# Altium schematic sheet PAGE02_机场端电源.SchDoc
size A4
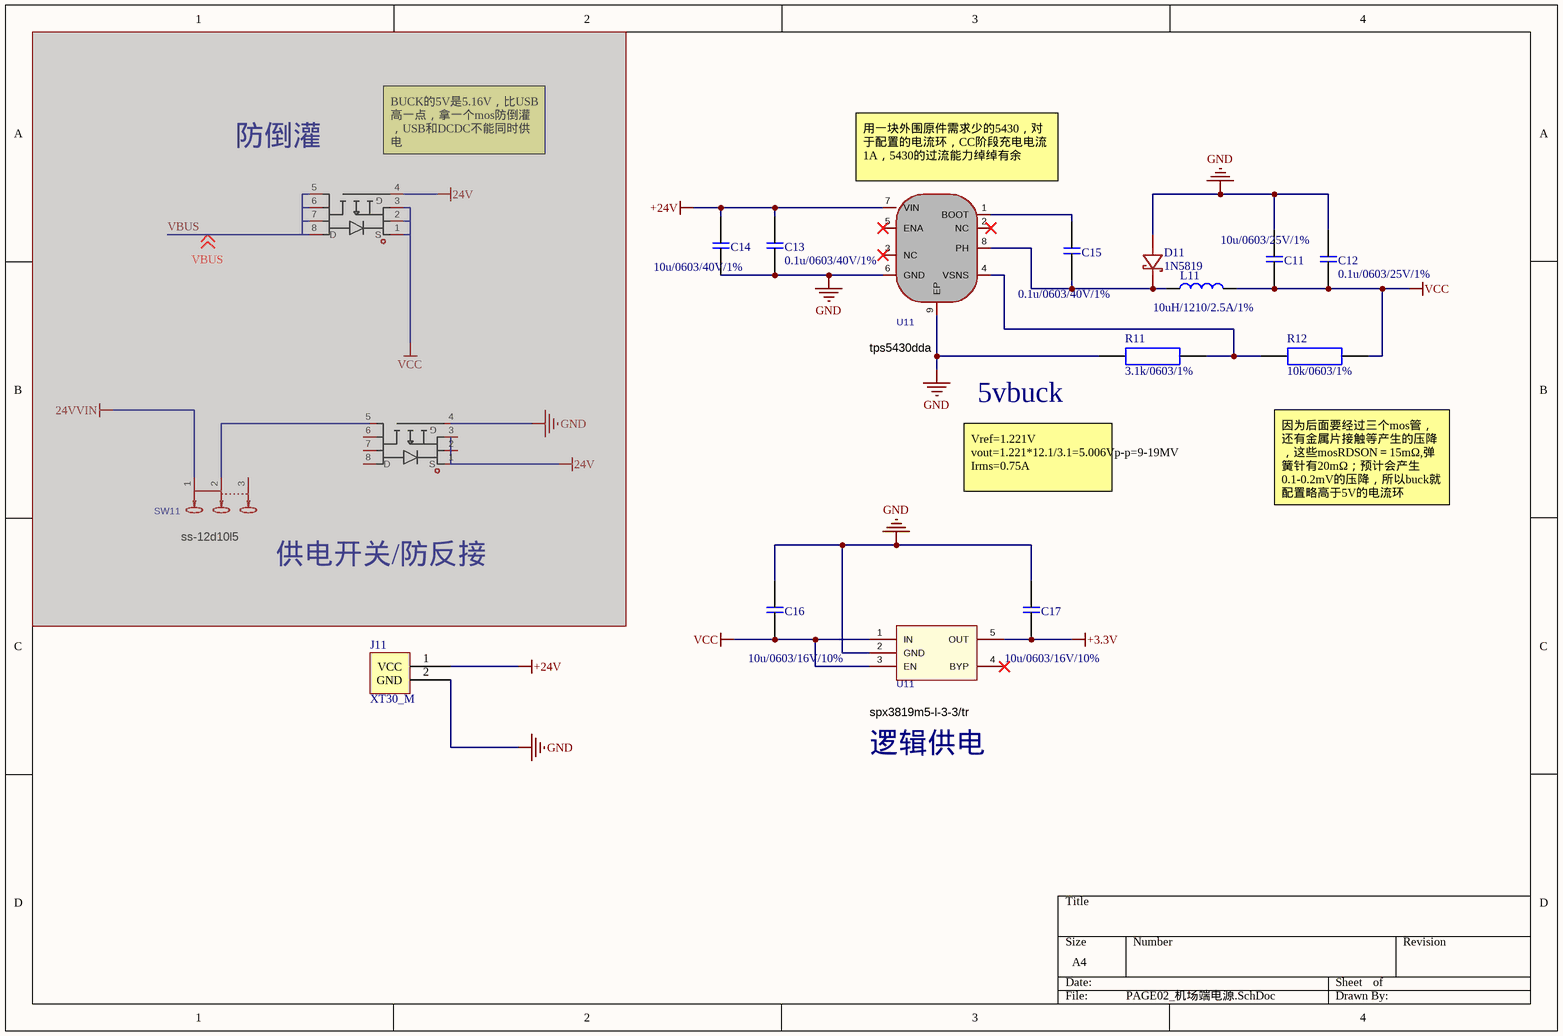
[diagram p0: PAGE02_机场端电源.SchDoc]

## Parts
(Parts that share a designator on the sheet are numbered #1, #2 ... from top to bottom, then left to right.)
C11  10u/0603/25V/1%  [0603_ding_C]
C12  0.1u/0603/25V/1%  [0603_ding_C]
C13  0.1u/0603/40V/1%  [0603_ding_C]
C14  10u/0603/40V/1%  [0603_ding_C]
C15  0.1u/0603/40V/1%  [0603_ding_C]
C16  10u/0603/16V/10%  [0603_ding_C]
C17  10u/0603/16V/10%  [0603_ding_C]
D11  1N5819  [SMA_L4.4-W2.6-LS5.0-RD]
J11  XT30_M  [XT30（立式）]
L11  10uH/1210/2.5A/1%  [1210_ding_C]
Q11  ao4435  [SOP-8_L5.0-W3.8-P1.27-LS6.0-BL]  (value not drawn)  (masked out: inside a compile mask, not in the netlist)
Q12  ao4435  [SOP-8_L5.0-W3.8-P1.27-LS6.0-BL]  (value not drawn)  (masked out: inside a compile mask, not in the netlist)
R11  3.1k/0603/1%  [0603_ding_R]
R12  10k/0603/1%  [0603_ding_R]
SW11  ss-12d10l5  [SW-TH_SS-12D10L5]  (masked out: inside a compile mask, not in the netlist)
U11#1  tps5430dda  [SOIC-8_EP_150mil]
U11#2  spx3819m5-l-3-3/tr  [SOT-23-5_L3.0-W1.7-P0.95-LS2.8-BL]

## Nets
+3.3V: C17.1 U11#2.5(OUT)
+24V: C13.2 C14.2 J11.1(VCC) U11#1.7(VIN)
GND: C11.2 C12.2 C13.1 C14.1 C16.2 C17.2 D11.2(A) J11.2(GND) R11.2 U11#1.6(GND) U11#1.9(EP) U11#2.2(GND)
VCC: C11.1 C12.1 C16.1 L11.2 R12.1 U11#2.1(IN) U11#2.3(EN)
NetC15_1: C15.1 U11#1.1(BOOT)
NetC15_2: C15.2 D11.1(C) L11.1 U11#1.8(PH)
NetR11_1: R11.1 R12.2 U11#1.4(VSNS)

Not connected (* = marked no-connect by the designer): U11#1 2(NC)* 3(NC)* 5(ENA)*; U11#2 4(BYP)*

## Notes on the sheet
- 防倒灌
- (near Q12) BUCK的5V是5.16V，比USB高一点，拿一个mos防倒灌，USB和DCDC不能同时供电
- (near U11#1) 用一块外围原件需求少的5430，对于配置的电流环，CC阶段充电电流1A，5430的过流能力绰绰有余
- 5vbuck
- Vref=1.221V
  vout=1.221*12.1/3.1=5.006Vp-p=9-19MV
  Irms=0.75A
- 因为后面要经过三个mos管，还有金属片接触等产生的压降，这些mosRDSON＝15mΩ,弹簧针有20mΩ；预计会产生0.1-0.2mV的压降，所以buck就配置略高于5V的电流环
- 供电开关/防反接
- 逻辑供电

## Library data of the parts
C11-C17 = C
L11 = L-ip6826
Q11 Q12 = ao4435: 数量:1个P沟道;漏源电压(Vdss):30V;连续漏极电流(Id):12A;导通电阻(RDS(on)):15mΩ@10V;耗散功率(Pd):2.5W;阈值电压(Vgs(th)):3V;; Manufacturer: UMW(友台半导体); Symbol: AO4435_C2944310; AddInBom: yes; ModelId: 823e4ad1ee284f09bfed9f55dae295e0; ModelTransform: 196.85,236.22,0,0,0,0,0,0,0; Number: 1个P沟道; Drain to Source Voltage: 30V; Current - Continuous Drain(Id): 12A; Pd - Power Dissipation: 2.5W; Gate Threshold Voltage (Vgs(th)): 3V; Gate Charge(Qg): 18nC; Input Capacitance(Ciss): 1.175nF; Reverse Transfer Capacitance (Crss@Vds): 190pF; Output Capacitance(Coss): 195pF; LCSC Part Name: 1个P沟道 耐压:30V 电流:12A; SupplierPart: C2944310; ManufacturerPart: AO4435; Supplier Footprint: SOP-8; JLCPCB Part Class: Extended Part; Datasheet: https://item.szlcsc.com/datasheet/AO4435/3330325.html; Supplier: LCSC; ConvertToPcb: yes; FootprintName: SOP-8_L5.0-W3.8-P1.27-LS6.0-BL; ModelName: SOP-8_L5.0-W3.8-P1.27-LS6.0-BL; RDS(on): 15mΩ@10V; Operating Temperature: -55℃~+150℃
R11 R12 = RES
SW11 = ss-12d10l5: 电路结构:单刀双掷;安装方式:直插;开关颜色:黑色;额定电流:3A;额定电压:125V;工作寿命:1万次;; Manufacturer: XKB Connection(中国星坤); AddInBom: yes; ModelId: c49f07a32c154ec8ad7cf47670a53981; ModelName: SW-TH_L13.0-W6.8-H6.4-P4.7; ModelTransform: 511.81394,267.716,0,0,0,0,0,0,-220.472; Circuit: 单刀双掷; Actuator Style: 矩形柱状; Switch Height: 6.4mm; Actuator Color: 黑色; Current Rating: 3A; Voltage Rating: 125V; Life: 1万次; Symbol: SS-12D10L5; LCSC Part Name: 柄长5mm 直插双档 滑动开关; SupplierPart: C319012; ManufacturerPart: SS-12D10L5; Supplier Footprint: 插件,13x6.8mm; JLCPCB Part Class: Extended Part; Datasheet: https://item.szlcsc.com/datasheet/SS-12D10L5/300104.html; Supplier: LCSC; ConvertToPcb: yes; FootprintName: SW-TH_SS-12D10L5; Termination Style: PC引脚; Length: 13mm; Width: 6.8mm; Mounting Type: 直插; Operating Temperature: -40℃~+85℃
U11#1 = tps5430dda: 功能类型:降压型;工作电压:5.5V~36V;输出电压:1.221V~32.04V;输出电流:3A;输出类型:可调;; Manufacturer: TI(德州仪器); AddInBom: yes; ModelId: 0078439d9e964752ad4b3f828dcb5664; ModelName: ESOP-8_L4.9-W3.9-P1.27-LS6.0-BL-EP-2; ModelTransform: 192.913,236.22,0,0,0,0,0,0,0; Function: 降压型; Output Current: 3A; Frequency - Switching: 500kHz; Synchronous Rectifier: 否; Number of Outputs: 1; Topology: 降压式; Quiescent Current: 4.4mA; Switch tube (built-in/external): 内置; Output Type: 可调; Symbol: TPS5430DDA; LCSC Part Name: 降压型 3A 5.5V~36V; SupplierPart: C502477; ManufacturerPart: TPS5430DDA; Supplier Footprint: ESOP-8; JLCPCB Part Class: Extended Part; Datasheet: https://www.ti.com/cn/lit/ds/symlink/tps5430.pdf; Supplier: LCSC; ConvertToPcb: yes; FootprintName: ESOP-8_L4.9-W3.9-P1.27-LS6.0-BL-EP-2; Voltage - Supply: 5.5V~36V; Output Voltage: 1.221V~32.04V; Operating Temperature: -40℃~+125℃@(TJ); Features: 逐波限流；过流保护；打嗝限流
U11#2 = spx3819m5-l-3-3/tr: 输出极性:正极;工作电压:16V;输出电压:3.3V;输出电流:500mA;电源纹波抑制比(PSRR):70dB;输出类型:固定;; Manufacturer: MaxLinear(迈凌); AddInBom: yes; ModelId: 0a2a1b8f50944f73965918ad6e5fe167; ModelName: SOT-23-5_L2.9-W1.6-H1.1-LS2.8-P0.95; ModelTransform: 118.60433,114.173,0,90,0,0,0.0005,0.0005,0; Output Configuration: 正极; Voltage - Supply: 16V; Output Voltage: 3.3V; Output Current: 500mA; Power Supply Rejection Ratio (PSRR): 70dB; Voltage Dropout: 340mV@(500mA); standby current: 90uA; Noise: 40uVrms; Output Type: 固定; Number of Outputs: 1; Symbol: SPX3819M5-L-3-3/TR; LCSC Part Name: 3.3V 500mA 16V; SupplierPart: C9055; ManufacturerPart: SPX3819M5-L-3-3/TR; Supplier Footprint: SOT-23-5; JLCPCB Part Class: Extended Part; Datasheet: https://item.szlcsc.com/datasheet/SPX3819M5-L-3-3%252FTR/9575.html; Supplier: LCSC; ConvertToPcb: yes; FootprintName: SOT-23-5_L3.0-W1.7-P0.95-LS2.8-BL; Features: 过流保护；反极性电压保护；使能控制；噪声旁路端子；热关断; Operating Temperature: -40℃~+125℃